# EasyEDA schematic SCH_DroneSlider_Circuit.json
TITLE: Drone Slider Controller; REV: 1.0; Date: 2024-09-21; Sheet: 1/1; Drawn By: NotMe; Company: Aperture Labs
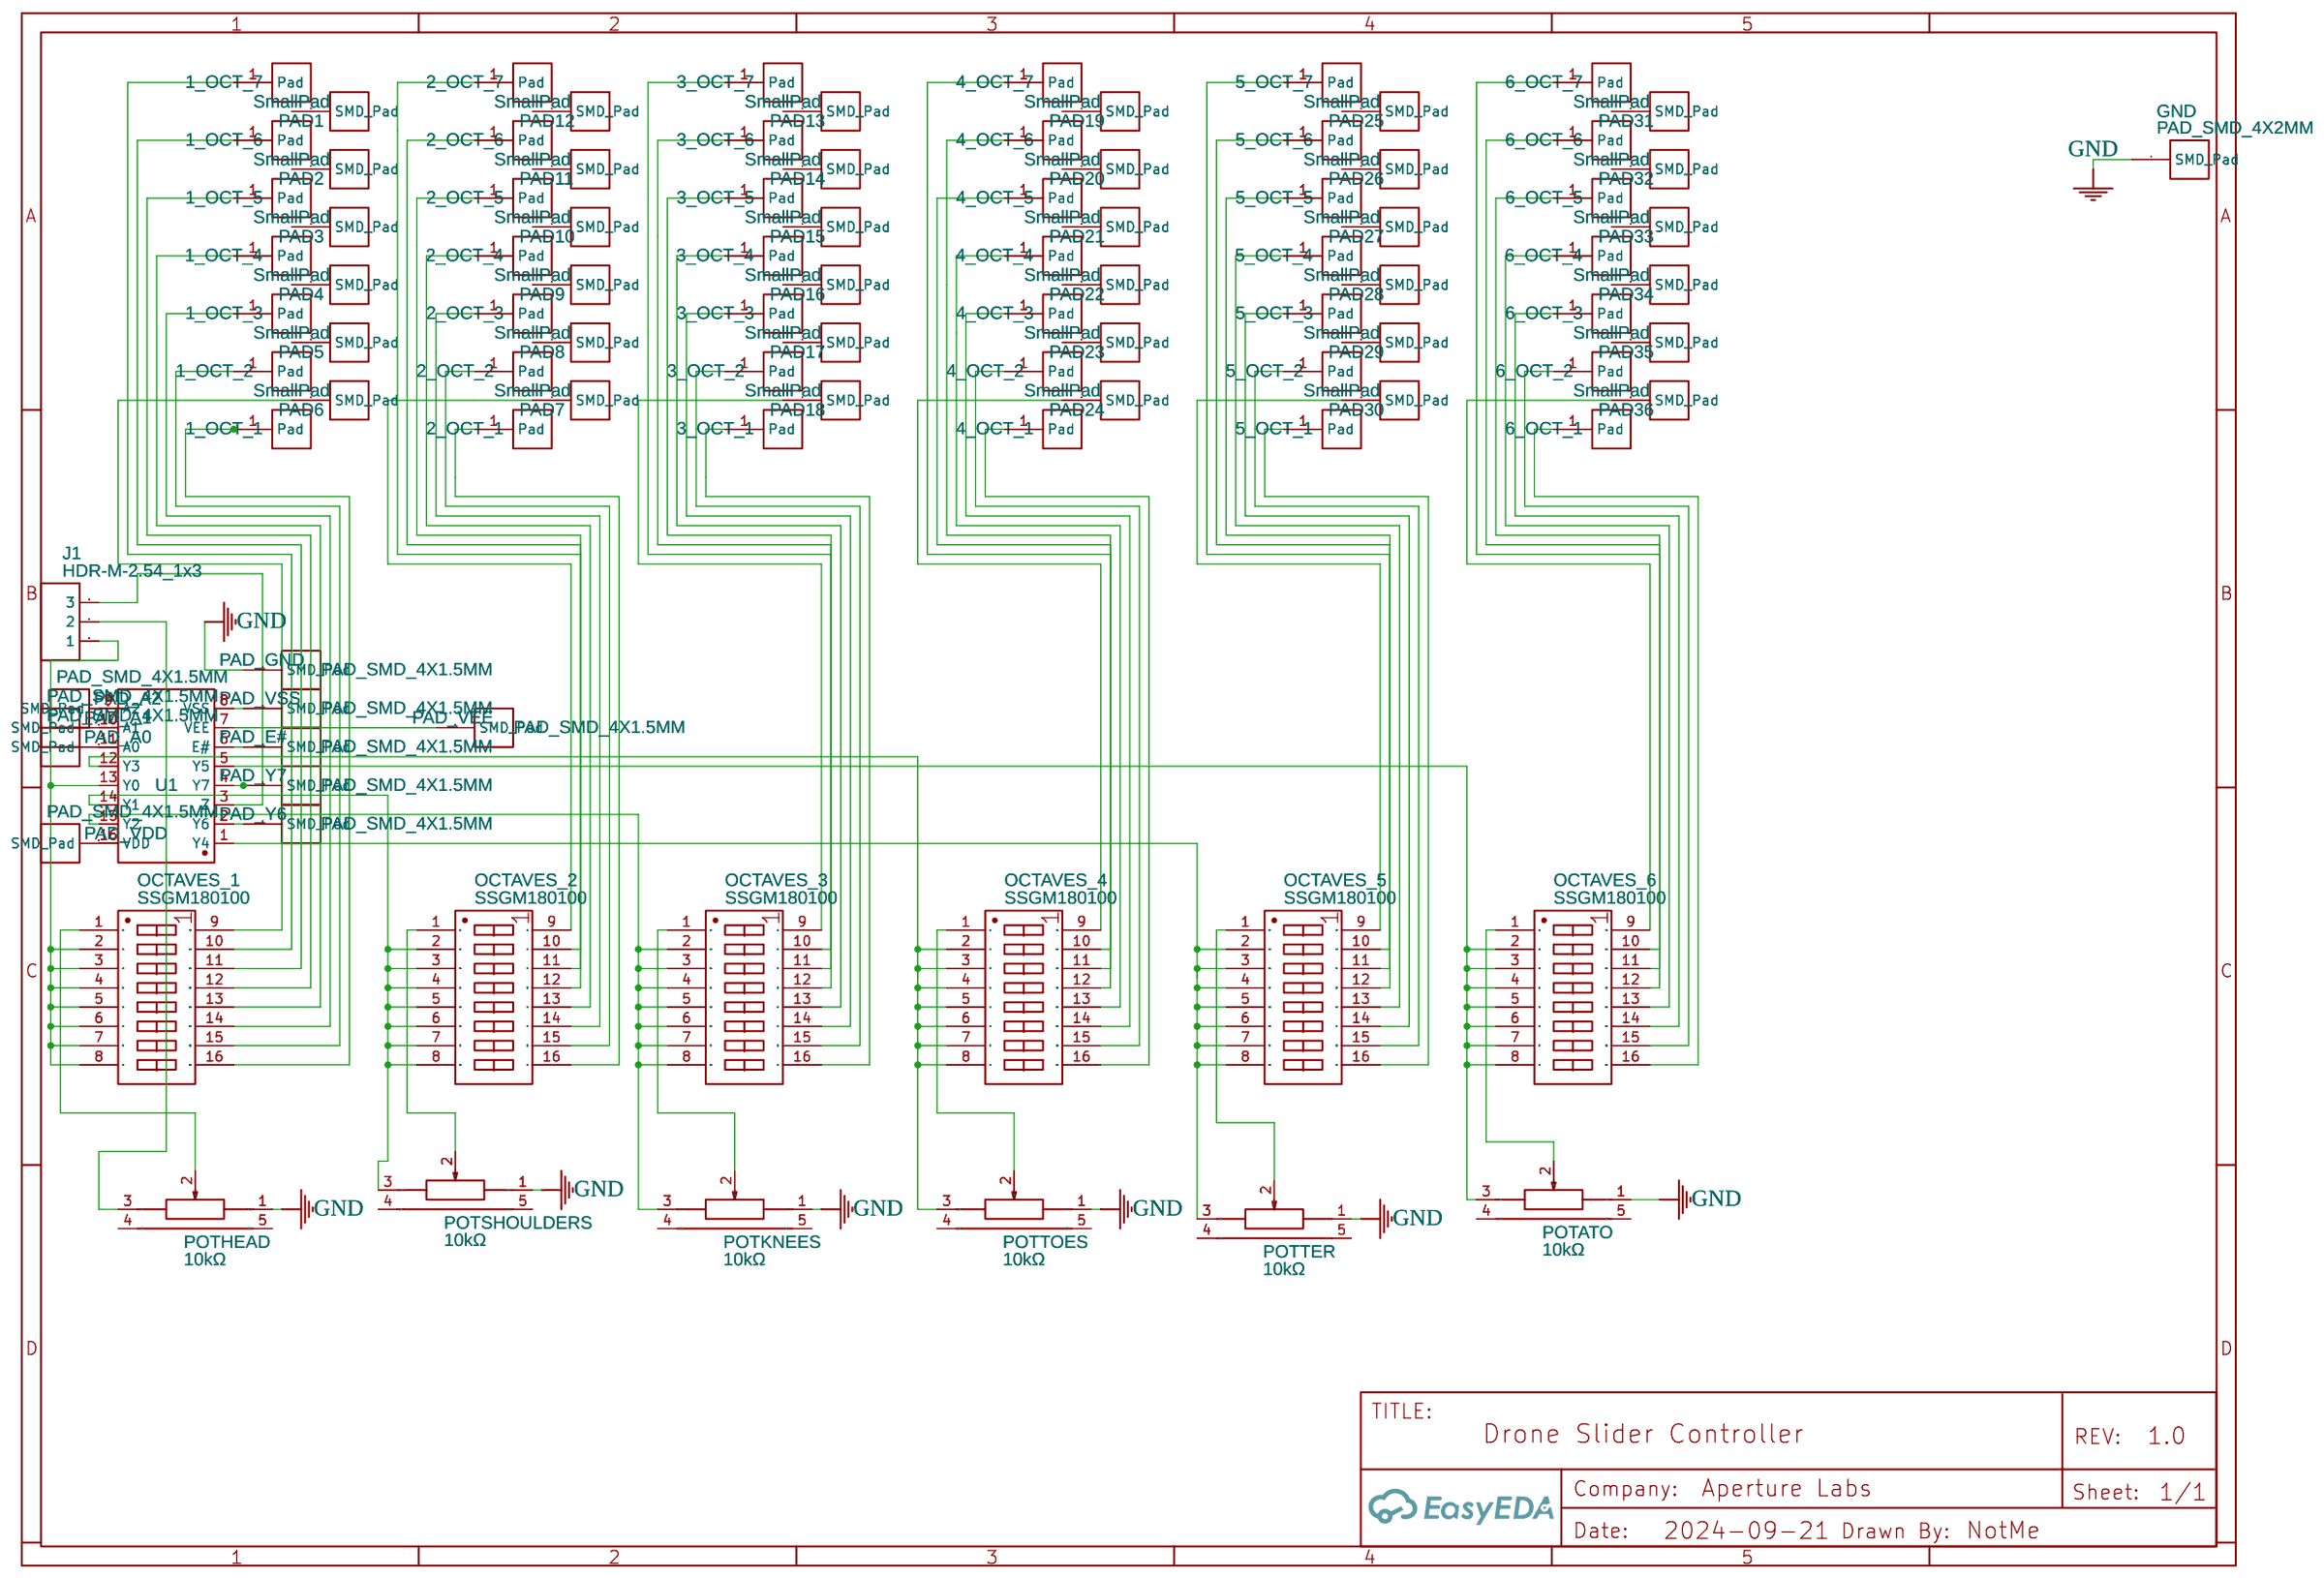
[diagram p0: schematic sheet]

## Parts
1_OCT_1  OCT  [PADPAD]
1_OCT_2  OCT  [PADPAD]
1_OCT_3  OCT  [PADPAD]
1_OCT_4  OCT  [PADPAD]
1_OCT_5  OCT  [PADPAD]
1_OCT_6  OCT  [PADPAD]
1_OCT_7  OCT  [PADPAD]
2_OCT_1  OCT  [PADPAD]
2_OCT_2  OCT  [PADPAD]
2_OCT_3  OCT  [PADPAD]
2_OCT_4  OCT  [PADPAD]
2_OCT_5  OCT  [PADPAD]
2_OCT_6  OCT  [PADPAD]
2_OCT_7  OCT  [PADPAD]
3_OCT_1  OCT  [PADPAD]
3_OCT_2  OCT  [PADPAD]
3_OCT_3  OCT  [PADPAD]
3_OCT_4  OCT  [PADPAD]
3_OCT_5  OCT  [PADPAD]
3_OCT_6  OCT  [PADPAD]
3_OCT_7  OCT  [PADPAD]
4_OCT_1  OCT  [PADPAD]
4_OCT_2  OCT  [PADPAD]
4_OCT_3  OCT  [PADPAD]
4_OCT_4  OCT  [PADPAD]
4_OCT_5  OCT  [PADPAD]
4_OCT_6  OCT  [PADPAD]
4_OCT_7  OCT  [PADPAD]
5_OCT_1  OCT  [PADPAD]
5_OCT_2  OCT  [PADPAD]
5_OCT_3  OCT  [PADPAD]
5_OCT_4  OCT  [PADPAD]
5_OCT_5  OCT  [PADPAD]
5_OCT_6  OCT  [PADPAD]
5_OCT_7  OCT  [PADPAD]
6_OCT_1  OCT  [PADPAD]
6_OCT_2  OCT  [PADPAD]
6_OCT_3  OCT  [PADPAD]
6_OCT_4  OCT  [PADPAD]
6_OCT_5  OCT  [PADPAD]
6_OCT_6  OCT  [PADPAD]
6_OCT_7  OCT  [PADPAD]
GND  PAD_SMD_4X2MM  [PADPAD]
J1  HDR-M-2.54_1x3  [HDR-M-2.54_1X3]
OCTAVES_1  SSGM180100  [SW-TH_16P-L22.1-W7.62-P2.54-LS7.62]
OCTAVES_2  SSGM180100  [SW-TH_16P-L22.1-W7.62-P2.54-LS7.62]
OCTAVES_3  SSGM180100  [SW-TH_16P-L22.1-W7.62-P2.54-LS7.62]
OCTAVES_4  SSGM180100  [SW-TH_16P-L22.1-W7.62-P2.54-LS7.62]
OCTAVES_5  SSGM180100  [SW-TH_16P-L22.1-W7.62-P2.54-LS7.62]
OCTAVES_6  SSGM180100  [SW-TH_16P-L22.1-W7.62-P2.54-LS7.62]
PAD1  SmallPad  [PADPAD4X1.5]
PAD2  SmallPad  [PADPAD4X1.5]
PAD3  SmallPad  [PADPAD4X1.5]
PAD4  SmallPad  [PADPAD4X1.5]
PAD5  SmallPad  [PADPAD4X1.5]
PAD6  SmallPad  [PADPAD4X1.5]
PAD7  SmallPad  [PADPAD4X1.5]
PAD8  SmallPad  [PADPAD4X1.5]
PAD9  SmallPad  [PADPAD4X1.5]
PAD10  SmallPad  [PADPAD4X1.5]
PAD11  SmallPad  [PADPAD4X1.5]
PAD12  SmallPad  [PADPAD4X1.5]
PAD13  SmallPad  [PADPAD4X1.5]
PAD14  SmallPad  [PADPAD4X1.5]
PAD15  SmallPad  [PADPAD4X1.5]
PAD16  SmallPad  [PADPAD4X1.5]
PAD17  SmallPad  [PADPAD4X1.5]
PAD18  SmallPad  [PADPAD4X1.5]
PAD19  SmallPad  [PADPAD4X1.5]
PAD20  SmallPad  [PADPAD4X1.5]
PAD21  SmallPad  [PADPAD4X1.5]
PAD22  SmallPad  [PADPAD4X1.5]
PAD23  SmallPad  [PADPAD4X1.5]
PAD24  SmallPad  [PADPAD4X1.5]
PAD25  SmallPad  [PADPAD4X1.5]
PAD26  SmallPad  [PADPAD4X1.5]
PAD27  SmallPad  [PADPAD4X1.5]
PAD28  SmallPad  [PADPAD4X1.5]
PAD29  SmallPad  [PADPAD4X1.5]
PAD30  SmallPad  [PADPAD4X1.5]
PAD31  SmallPad  [PADPAD4X1.5]
PAD32  SmallPad  [PADPAD4X1.5]
PAD33  SmallPad  [PADPAD4X1.5]
PAD34  SmallPad  [PADPAD4X1.5]
PAD35  SmallPad  [PADPAD4X1.5]
PAD36  SmallPad  [PADPAD4X1.5]
PAD_A0  PAD_SMD_4X1.5MM  [PADPAD4X1.5]
PAD_A1  PAD_SMD_4X1.5MM  [PADPAD4X1.5]
PAD_A2  PAD_SMD_4X1.5MM  [PADPAD4X1.5]
PAD_E#  PAD_SMD_4X1.5MM  [PADPAD4X1.5]
PAD_GND  PAD_SMD_4X1.5MM  [PADPAD4X1.5]
PAD_VDD  PAD_SMD_4X1.5MM  [PADPAD4X1.5]
PAD_VEE  PAD_SMD_4X1.5MM  [PADPAD4X1.5]
PAD_VSS  PAD_SMD_4X1.5MM  [PADPAD4X1.5]
PAD_Y6  PAD_SMD_4X1.5MM  [PADPAD4X1.5]
PAD_Y7  PAD_SMD_4X1.5MM  [PADPAD4X1.5]
POTATO  10kΩ  [RES-ADJ-TH_RK09K1130A5R]
POTHEAD  10kΩ  [RES-ADJ-TH_RK09K1130A5R]
POTKNEES  10kΩ  [RES-ADJ-TH_RK09K1130A5R]
POTSHOULDERS  10kΩ  [RES-ADJ-TH_RK09K1130A5R]
POTTER  10kΩ  [RES-ADJ-TH_RK09K1130A5R]
POTTOES  10kΩ  [RES-ADJ-TH_RK09K1130A5R]
U1  CD4051BE_C507164  [DIP-16_L20.0-W6.4-P2.54-LS7.6-BL]

## Library data of the parts
1_OCT_1-1_OCT_7 2_OCT_1-2_OCT_7 3_OCT_1-3_OCT_7 4_OCT_1-4_OCT_7 5_OCT_1-5_OCT_7 6_OCT_1-6_OCT_7 = PAD: Contributor: HeinrichsEngineering
GND = PAD_SMD_4X2MM: Contributor: f Beltran
J1 = HDR-M-2.54_1x3: Supplier Part: C180248; Supplier: LCSC; Contributor: LCEDA_Lib
OCTAVES_1-OCTAVES_6 = SSGM180100: Contributor: LCSC; Supplier: LCSC; Supplier Part: C470276; Manufacturer: ALPSALPINE(阿尔卑斯阿尔派); JLCPCB Part Class: Extended Part
PAD1-PAD36 PAD_A0-PAD_A2 PAD_E# PAD_GND PAD_VDD PAD_VEE PAD_VSS PAD_Y6 PAD_Y7 = PAD_SMD_4X1.5MM: Contributor: f Beltran
POTATO POTHEAD POTKNEES POTSHOULDERS POTTER POTTOES = RK09K1130A5R: Contributor: LCSC; Supplier: LCSC; Supplier Part: C209779; Manufacturer: ALPSALPINE(阿尔卑斯阿尔派); JLCPCB Part Class: Extended Part; link: https://lcsc.com/eda_search?q=C209779&%26type=1&ref=editor
U1 = CD4051BE_C507164: Contributor: LCSC; Supplier: LCSC; Supplier Part: C507164; Manufacturer: HGSEMI(华冠); Manufacturer Part: CD4051BE; JLCPCB Part Class: Extended Part; link: https://lcsc.com/eda_search?q=C507164&%26type=1&ref=editor

## Nets
GND: GND.1(SMD Pad) PAD_GND.1(SMD Pad) POTATO.1 POTHEAD.1 POTKNEES.1 POTSHOULDERS.1 POTTER.1 POTTOES.1
Net-(1_OCT_1-1): 1_OCT_1.1(Pad) OCTAVES_1.16(PIN16)
Net-(1_OCT_2-1): 1_OCT_2.1(Pad) OCTAVES_1.15(PIN16)
Net-(1_OCT_3-1): 1_OCT_3.1(Pad) OCTAVES_1.14(PIN14)
Net-(1_OCT_4-1): 1_OCT_4.1(Pad) OCTAVES_1.13(PIN13)
Net-(1_OCT_5-1): 1_OCT_5.1(Pad) OCTAVES_1.12(PIN12)
Net-(1_OCT_6-1): 1_OCT_6.1(Pad) OCTAVES_1.11(PIN11)
Net-(1_OCT_7-1): 1_OCT_7.1(Pad) OCTAVES_1.10(PIN10)
Net-(2_OCT_1-1): 2_OCT_1.1(Pad) OCTAVES_2.16(PIN16)
Net-(2_OCT_2-1): 2_OCT_2.1(Pad) OCTAVES_2.15(PIN16)
Net-(2_OCT_3-1): 2_OCT_3.1(Pad) OCTAVES_2.14(PIN14)
Net-(2_OCT_4-1): 2_OCT_4.1(Pad) OCTAVES_2.13(PIN13)
Net-(2_OCT_5-1): 2_OCT_5.1(Pad) OCTAVES_2.12(PIN12)
Net-(2_OCT_6-1): 2_OCT_6.1(Pad) OCTAVES_2.11(PIN11)
Net-(2_OCT_7-1): 2_OCT_7.1(Pad) OCTAVES_2.10(PIN10)
Net-(3_OCT_1-1): 3_OCT_1.1(Pad) OCTAVES_3.16(PIN16)
Net-(3_OCT_2-1): 3_OCT_2.1(Pad) OCTAVES_3.15(PIN16)
Net-(3_OCT_3-1): 3_OCT_3.1(Pad) OCTAVES_3.14(PIN14)
Net-(3_OCT_4-1): 3_OCT_4.1(Pad) OCTAVES_3.13(PIN13)
Net-(3_OCT_5-1): 3_OCT_5.1(Pad) OCTAVES_3.12(PIN12)
Net-(3_OCT_6-1): 3_OCT_6.1(Pad) OCTAVES_3.11(PIN11)
Net-(3_OCT_7-1): 3_OCT_7.1(Pad) OCTAVES_3.10(PIN10)
Net-(4_OCT_1-1): 4_OCT_1.1(Pad) OCTAVES_4.16(PIN16)
Net-(4_OCT_2-1): 4_OCT_2.1(Pad) OCTAVES_4.15(PIN16)
Net-(4_OCT_3-1): 4_OCT_3.1(Pad) OCTAVES_4.14(PIN14)
Net-(4_OCT_4-1): 4_OCT_4.1(Pad) OCTAVES_4.13(PIN13)
Net-(4_OCT_5-1): 4_OCT_5.1(Pad) OCTAVES_4.11(PIN11)
Net-(4_OCT_6-1): 4_OCT_6.1(Pad) OCTAVES_4.12(PIN12)
Net-(4_OCT_7-1): 4_OCT_7.1(Pad) OCTAVES_4.10(PIN10)
Net-(5_OCT_1-1): 5_OCT_1.1(Pad) OCTAVES_5.16(PIN16)
Net-(5_OCT_2-1): 5_OCT_2.1(Pad) OCTAVES_5.15(PIN16)
Net-(5_OCT_3-1): 5_OCT_3.1(Pad) OCTAVES_5.14(PIN14)
Net-(5_OCT_4-1): 5_OCT_4.1(Pad) OCTAVES_5.13(PIN13)
Net-(5_OCT_5-1): 5_OCT_5.1(Pad) OCTAVES_5.12(PIN12)
Net-(5_OCT_6-1): 5_OCT_6.1(Pad) OCTAVES_5.11(PIN11)
Net-(5_OCT_7-1): 5_OCT_7.1(Pad) OCTAVES_5.10(PIN10)
Net-(6_OCT_1-1): 6_OCT_1.1(Pad) OCTAVES_6.16(PIN16)
Net-(6_OCT_2-1): 6_OCT_2.1(Pad) OCTAVES_6.15(PIN16)
Net-(6_OCT_3-1): 6_OCT_3.1(Pad) OCTAVES_6.14(PIN14)
Net-(6_OCT_4-1): 6_OCT_4.1(Pad) OCTAVES_6.13(PIN13)
Net-(6_OCT_5-1): 6_OCT_5.1(Pad) OCTAVES_6.12(PIN12)
Net-(6_OCT_6-1): 6_OCT_6.1(Pad) OCTAVES_6.11(PIN11)
Net-(6_OCT_7-1): 6_OCT_7.1(Pad) OCTAVES_6.10(PIN10)
Net-(J1-1): J1.1 OCTAVES_1.2(PIN2) OCTAVES_1.3(PIN3) OCTAVES_1.4(PIN4) OCTAVES_1.5(PIN5) OCTAVES_1.6(PIN6) OCTAVES_1.7(PIN7) OCTAVES_1.8(PIN8) U1.13(Y0)
Net-(J1-2): J1.2 POTHEAD.3
Net-(J1-3): J1.3 U1.3(Z)
Net-(OCTAVES_1-1): OCTAVES_1.1(PIN1) POTHEAD.2
Net-(OCTAVES_1-9): OCTAVES_1.9(PIN9) PAD6.1(SMD Pad)
Net-(OCTAVES_2-1): OCTAVES_2.1(PIN1) POTSHOULDERS.2
Net-(OCTAVES_2-2): OCTAVES_2.2(PIN2) OCTAVES_2.3(PIN3) OCTAVES_2.4(PIN4) OCTAVES_2.5(PIN5) OCTAVES_2.6(PIN6) OCTAVES_2.7(PIN7) OCTAVES_2.8(PIN8) POTSHOULDERS.3 U1.14(Y1)
Net-(OCTAVES_2-9): OCTAVES_2.9(PIN9) PAD7.1(SMD Pad)
Net-(OCTAVES_3-1): OCTAVES_3.1(PIN1) POTKNEES.2
Net-(OCTAVES_3-2): OCTAVES_3.2(PIN2) OCTAVES_3.3(PIN3) OCTAVES_3.4(PIN4) OCTAVES_3.5(PIN5) OCTAVES_3.6(PIN6) OCTAVES_3.7(PIN7) OCTAVES_3.8(PIN8) POTKNEES.3 U1.15(Y2)
Net-(OCTAVES_3-9): OCTAVES_3.9(PIN9) PAD18.1(SMD Pad)
Net-(OCTAVES_4-1): OCTAVES_4.1(PIN1) POTTOES.2
Net-(OCTAVES_4-2): OCTAVES_4.2(PIN2) OCTAVES_4.3(PIN3) OCTAVES_4.4(PIN4) OCTAVES_4.5(PIN5) OCTAVES_4.6(PIN6) OCTAVES_4.7(PIN7) OCTAVES_4.8(PIN8) POTTOES.3 U1.12(Y3)
Net-(OCTAVES_4-9): OCTAVES_4.9(PIN9) PAD24.1(SMD Pad)
Net-(OCTAVES_5-1): OCTAVES_5.1(PIN1) POTTER.2
Net-(OCTAVES_5-2): OCTAVES_5.2(PIN2) OCTAVES_5.3(PIN3) OCTAVES_5.4(PIN4) OCTAVES_5.5(PIN5) OCTAVES_5.6(PIN6) OCTAVES_5.7(PIN7) OCTAVES_5.8(PIN8) POTTER.3 U1.1(Y4)
Net-(OCTAVES_5-9): OCTAVES_5.9(PIN9) PAD30.1(SMD Pad)
Net-(OCTAVES_6-1): OCTAVES_6.1(PIN1) POTATO.2
Net-(OCTAVES_6-2): OCTAVES_6.2(PIN2) OCTAVES_6.3(PIN3) OCTAVES_6.4(PIN4) OCTAVES_6.5(PIN5) OCTAVES_6.6(PIN6) OCTAVES_6.7(PIN7) OCTAVES_6.8(PIN8) POTATO.3 U1.5(Y5)
Net-(OCTAVES_6-9): OCTAVES_6.9(PIN9) PAD36.1(SMD Pad)
Net-(PAD_A0-1): PAD_A0.1(SMD Pad) U1.11(A0)
Net-(PAD_A1-1): PAD_A1.1(SMD Pad) U1.10(A1)
Net-(PAD_A2-1): PAD_A2.1(SMD Pad) U1.9(A2)
Net-(PAD_E#-1): PAD_E#.1(SMD Pad) U1.6(E#)
Net-(PAD_VDD-1): PAD_VDD.1(SMD Pad) U1.16(VDD)
Net-(PAD_VEE-1): PAD_VEE.1(SMD Pad) U1.7(VEE)
Net-(PAD_VSS-1): PAD_VSS.1(SMD Pad) U1.8(VSS)
Net-(PAD_Y6-1): PAD_Y6.1(SMD Pad) U1.2(Y6)
Net-(PAD_Y7-1): PAD_Y7.1(SMD Pad) U1.4(Y7)

Not connected (* = marked no-connect by the designer): PAD1 1(SMD Pad); PAD2 1(SMD Pad); PAD3 1(SMD Pad); PAD4 1(SMD Pad); PAD5 1(SMD Pad); PAD8 1(SMD Pad); PAD9 1(SMD Pad); PAD10 1(SMD Pad); PAD11 1(SMD Pad); PAD12 1(SMD Pad); PAD13 1(SMD Pad); PAD14 1(SMD Pad); PAD15 1(SMD Pad); PAD16 1(SMD Pad); PAD17 1(SMD Pad); PAD19 1(SMD Pad); PAD20 1(SMD Pad); PAD21 1(SMD Pad); PAD22 1(SMD Pad); PAD23 1(SMD Pad); PAD25 1(SMD Pad); PAD26 1(SMD Pad); PAD27 1(SMD Pad); PAD28 1(SMD Pad); PAD29 1(SMD Pad); PAD31 1(SMD Pad); PAD32 1(SMD Pad); PAD33 1(SMD Pad); PAD34 1(SMD Pad); PAD35 1(SMD Pad); POTATO 4(EH) 5(EH); POTHEAD 4(EH) 5(EH); POTKNEES 4(EH) 5(EH); POTSHOULDERS 4(EH) 5(EH); POTTER 4(EH) 5(EH); POTTOES 4(EH) 5(EH)
